# Altium schematic sheet MPU_Schem.SchDoc
size A; SheetNumber: 4; SheetTotal: 6
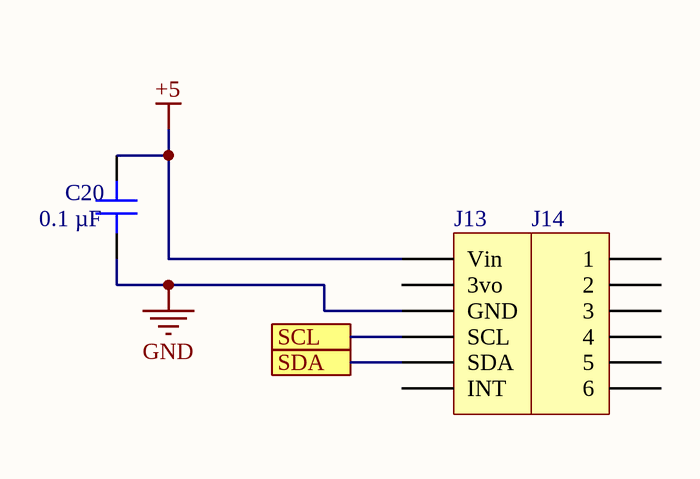
[diagram p0: MPU_Schem.SchDoc]

## Parts
C20  0.1 µF  [CAP 1210_3225 - 1MM]
J13  (no value)  [HDR1X6]
J14  (no value)  [HDR1X6]

## Ports
SCL, SDA

## Nets
+5: C20.2 J13.1(Vin)
GND: C20.1 J13.3(GND)
SCL: J13.4(SCL) ; port SCL
SDA: J13.5(SDA) ; port SDA

Not connected (* = marked no-connect by the designer): J13 2(3vo) 6(INT); J14 1 2 3 4 5 6

## Library data of the parts
C20 = C1210C104J5GACAUTO: CAP CER 0.1UF 50V C0G/NP0 1210; manufacturer: KEMET; Temperature Coefficient: C0G, NP0; Tolerance: ±5%; Part Number: C1210C104J5GACAUTO; Value: 0.1 µF; Applications: Automotive; Capacitance: 0.1 µF; componentlink1description: Datasheet; componentlink1url: https://api.kemet.com/component-edge/download/datasheet/C1210C104J5GACAUTO.pdf; componentlink2description: DigiKey Link; componentlink2url: https://www.digikey.com/en/products/detail/kemet/C1210C104J5GACAUTO/7516038; Device Package: 1210 (3225 Metric); Features: Low ESL; lastupdated: 9/19/2022 1:23:33 PM; Lifecycle Status: Active; Minimum Order: 1; Mounting Type: Surface Mount, MLCC; Operating Temperature: -55°C ~ 125°C; Package / Case: 1210 (3225 Metric); packaging: TapeAndReel; partid: 43680; Part Status: Active; price: 0.54; Ratings: AEC-Q200; series: SMD Auto C0G; Size / Dimension: 0.126" L x 0.098" W (3.20mm x 2.50mm); Supplier 1: DigiKey; Supplier Part Number 1: 399-15804-1-ND; Thickness (Max): 0.055" (1.40mm); Voltage - Rated: 50V
J13 J14 = Header 6: Header, 6-Pin; LatestRevisionDate: 17-Jul-2002; LatestRevisionNote: Re-released for DXP Platform.; Publisher: Altium Limited